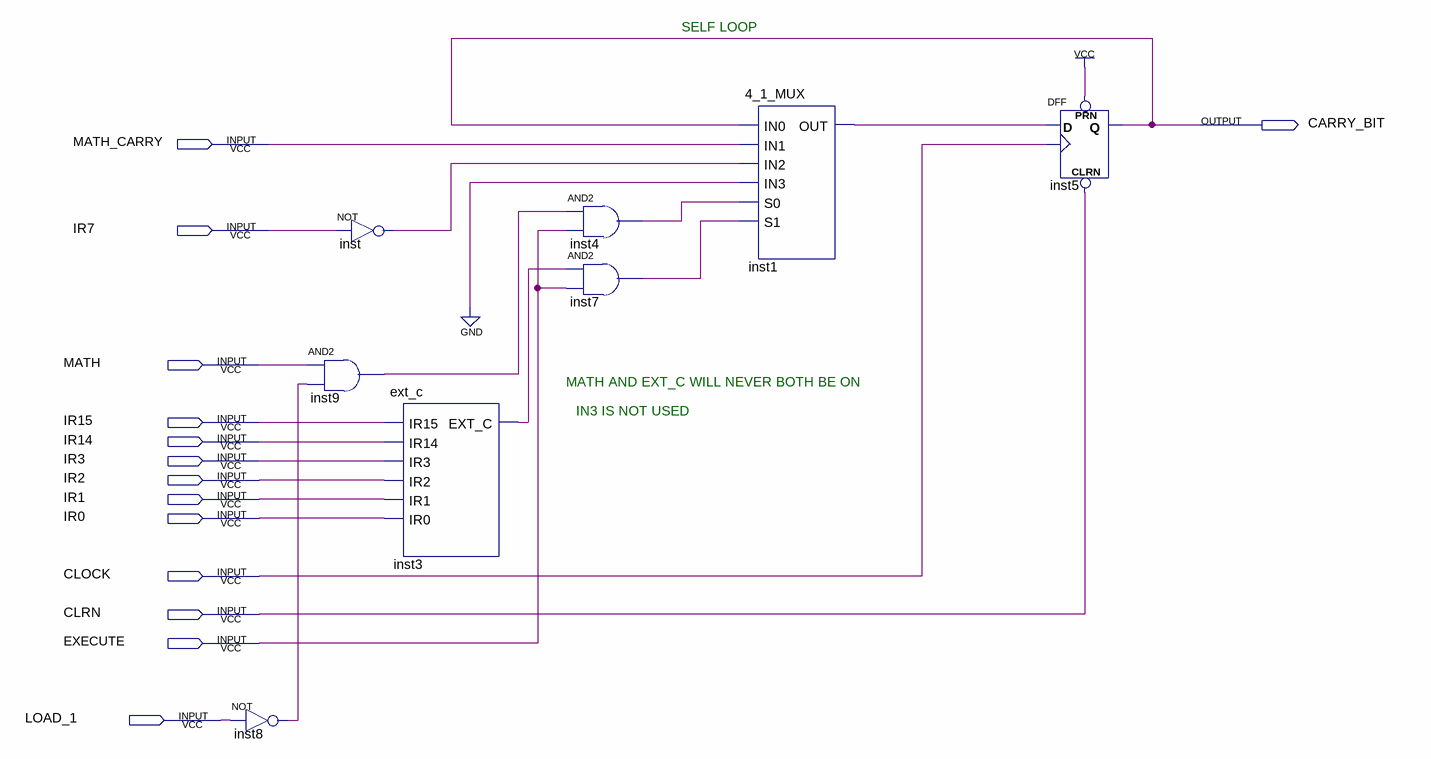
[diagram p0: schematic sheet]
// Quartus schematic CARRY_LOGIC.bdf as structural Verilog: 8 symbols, 14 pins
module CARRY_LOGIC (
  input  MATH_CARRY,
  input  IR7,
  input  MATH,
  input  IR15,
  input  IR14,
  input  IR3,
  input  IR2,
  input  IR1,
  input  IR0,
  input  CLOCK,
  input  CLRN,
  input  EXECUTE,
  input  LOAD_1,
  output CARRY_BIT
);

  wire inst1_out, inst3_ext_c, inst4_out, inst7_out, inst8_out, inst9_out, inst_out;

  not inst8 (inst8_out, LOAD_1);
  not inst (inst_out, IR7);
  and inst9 (inst9_out, MATH, inst8_out);
  ext_c inst3 (.IR15(IR15), .IR14(IR14), .IR3(IR3), .IR2(IR2), .IR1(IR1), .IR0(IR0), .EXT_C(inst3_ext_c));
  and inst4 (inst4_out, inst9_out, EXECUTE);
  and inst7 (inst7_out, inst3_ext_c, EXECUTE);
  \4_1_MUX  inst1 (
    .IN0(CARRY_BIT), .IN1(MATH_CARRY), .IN2(inst_out), .IN3(1'b0), .S0(inst4_out), .S1(inst7_out),
    .OUT(inst1_out));
  DFF inst5 (.CLRN(CLRN), .CLK(CLOCK), .D(inst1_out), .PRN(1'b1), .Q(CARRY_BIT));

  // Notes on the sheet:
  //   SELF LOOP
  //   MATH AND EXT_C WILL NEVER BOTH BE ON
  //   IN3 IS NOT USED
endmodule
